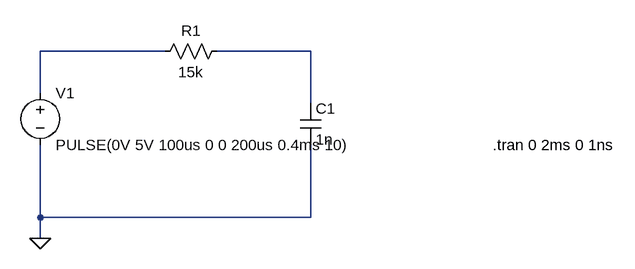
[diagram p0: schematic Draft1.asc]
Draft1.asc, the LTspice schematic file:
Version 4
SHEET 1 1072 680
WIRE 368 144 176 144
WIRE 592 144 448 144
WIRE 176 208 176 144
WIRE 592 224 592 144
WIRE 176 400 176 288
WIRE 592 400 592 288
WIRE 592 400 176 400
WIRE 176 432 176 400
FLAG 176 432 0
SYMBOL cap 576 224 R0
SYMATTR InstName C1
SYMATTR Value 1n
SYMBOL res 464 128 R90
WINDOW 0 0 56 VBottom 2
WINDOW 3 32 56 VTop 2
SYMATTR InstName R1
SYMATTR Value 15k
SYMBOL voltage 176 192 R0
SYMATTR InstName V1
SYMATTR Value PULSE(0V 5V 100us 0 0 200us 0.4ms 10)
TEXT 872 288 Left 2 !.tran 0 2ms 0 1ns

The netlist it stands for:
* Draft1.asc
C1 N002 0 1n
R1 N002 N001 15k
V1 N001 0 PULSE(0V 5V 100us 0 0 200us 0.4ms 10)
.tran 0 2ms 0 1ns
.backanno
.end